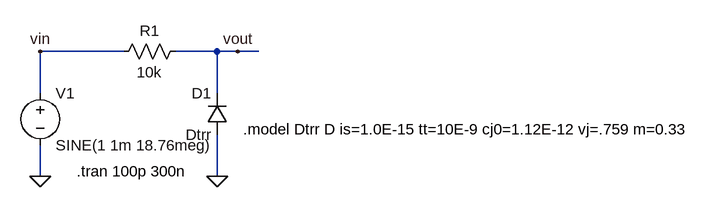
[diagram p0: schematic solution_of_2_8v1.asc]
solution_of_2_8v1.asc, the LTspice schematic file:
Version 4
SHEET 1 1064 680
WIRE 112 -48 -16 -48
WIRE 256 -48 192 -48
WIRE 288 -48 256 -48
WIRE 320 -48 288 -48
WIRE -16 16 -16 -48
WIRE 256 16 256 -48
WIRE -16 144 -16 96
WIRE 256 144 256 80
FLAG -16 144 0
FLAG 256 144 0
FLAG 288 -48 vout
FLAG -16 -48 vin
SYMBOL diode 272 80 R180
WINDOW 0 24 64 Left 2
WINDOW 3 24 0 Left 2
SYMATTR InstName D1
SYMATTR Value Dtrr
SYMBOL voltage -16 0 R0
WINDOW 123 0 0 Left 0
WINDOW 39 0 0 Left 0
SYMATTR InstName V1
SYMATTR Value SINE(1 1m 18.76meg)
SYMBOL res 208 -64 R90
WINDOW 0 0 56 VBottom 2
WINDOW 3 32 56 VTop 2
SYMATTR InstName R1
SYMATTR Value 10k
TEXT 40 136 Left 2 !.tran 100p 300n
TEXT 296 72 Left 2 !.model Dtrr D is=1.0E-15 tt=10E-9 cj0=1.12E-12 vj=.759 m=0.33

The netlist it stands for:
* solution_of_2_8v1.asc
D1 0 vout Dtrr
V1 vin 0 SINE(1 1m 18.76meg)
R1 vout vin 10k
.model D D
.lib standard.dio
.tran 100p 300n
.model Dtrr D is=1.0E-15 tt=10E-9 cj0=1.12E-12 vj=.759 m=0.33
.backanno
.end